# EAGLE schematic GSElogger (EAGLE 9.6.2)
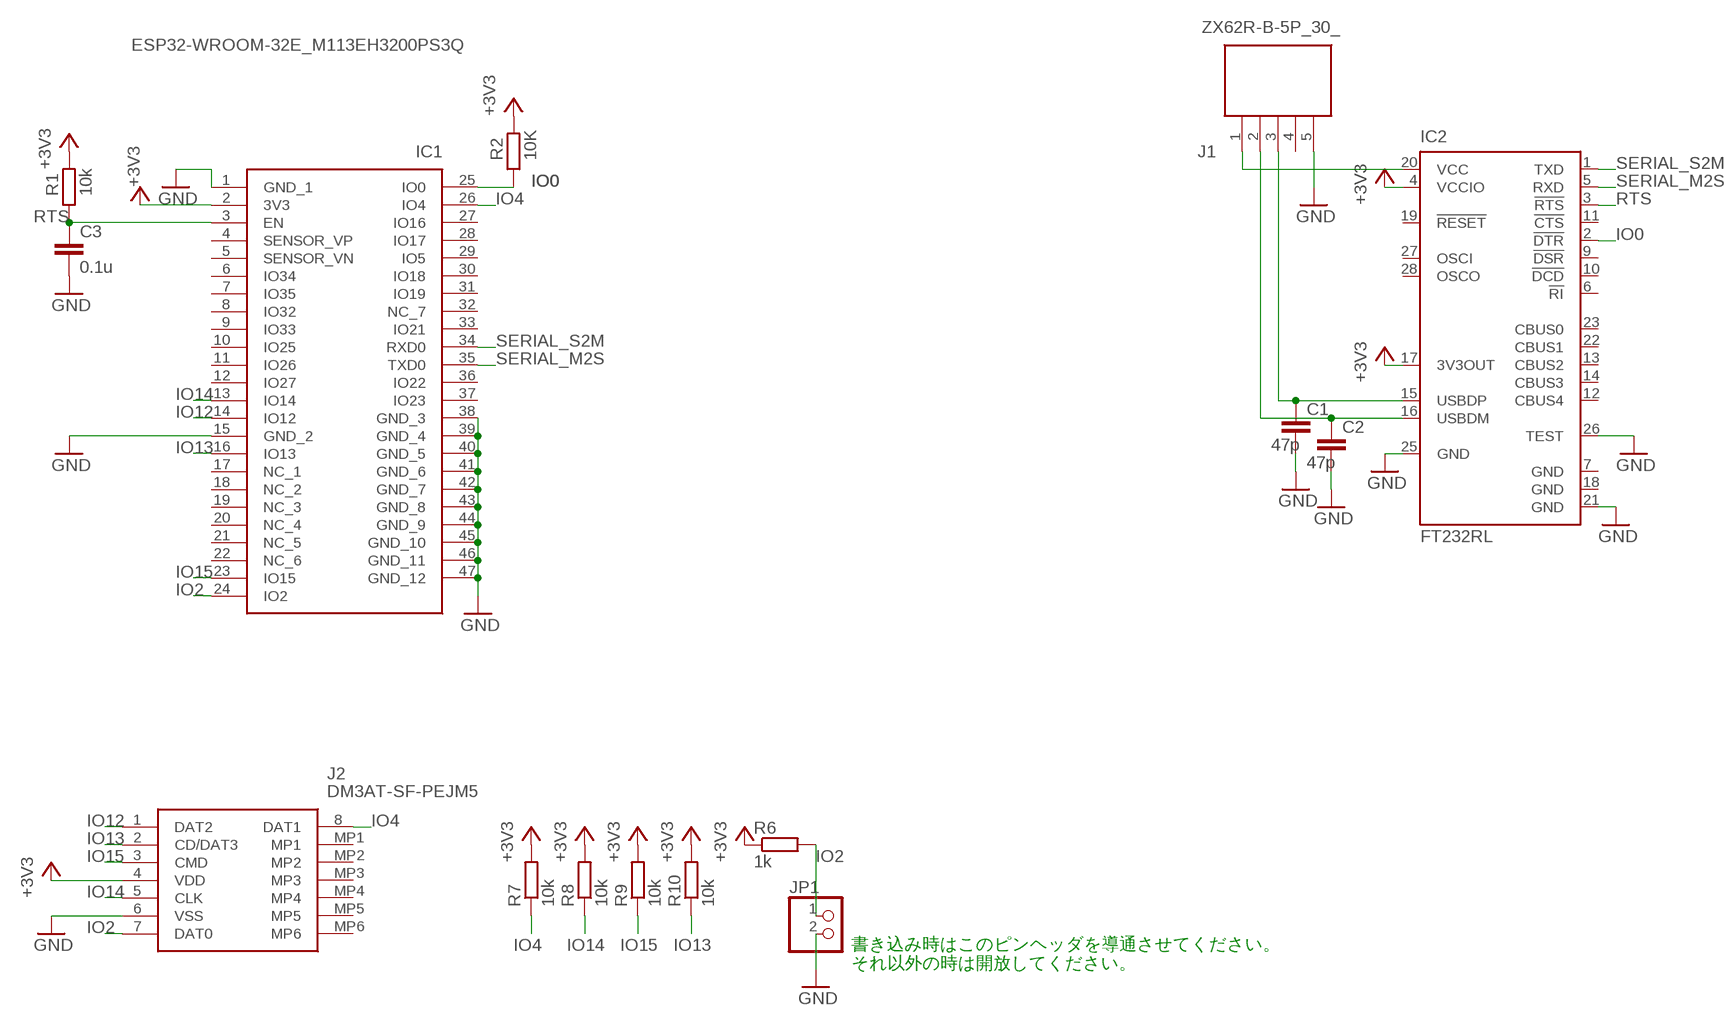
[diagram p0: schematic, sheet 1]

## Parts
C1  47p  C-EUC0603  [C0603]
C2  47p  C-EUC0603  [C0603]
C3  0.1u  C-EUC0603  [C0603]
IC1  ESP32-WROOM-32E_M113EH3200PS3Q  [ESP32WROOM32EM113EH3200PS3Q0]
IC2  FT232RL  [SSOP28]
J1  ZX62R-B-5P_30_  [ZX62R-B-5P(30)]
J2  DM3AT-SF-PEJM5  [DM3ATSFPEJM5]
JP1  PINHD-1X2  [1X02]
R1  10k  R-EU_R0603  [R0603]
R2  10K  R-EU_R0603  [R0603]
R6  1k  R-EU_R0603  [R0603]
R7  10k  R-EU_R0603  [R0603]
R8  10k  R-EU_R0603  [R0603]
R9  10k  R-EU_R0603  [R0603]
R10  10k  R-EU_R0603  [R0603]

## Nets
+3V3: IC1.2(3V3) IC2.4(VCCIO) IC2.17(3V3OUT) J2.4(VDD) R1.2 R2.2 R6.1 R7.2 R8.2 R9.2 R10.2
GND: C1.2 C2.2 C3.2 IC1.1(GND_1) IC1.15(GND_2) IC1.38(GND_3) IC1.39(GND_4) IC1.40(GND_5) IC1.41(GND_6) IC1.42(GND_7) IC1.43(GND_8) IC1.44(GND_9) IC1.45(GND_10) IC1.46(GND_11) IC1.47(GND_12) IC2.21(GND) IC2.25(GND) IC2.26(TEST) J1.5 J2.6(VSS) JP1.2
IO0: IC1.25(IO0) IC2.2(!DTR) R2.1
IO2: IC1.24(IO2) J2.7(DAT0) JP1.1 R6.2
IO4: IC1.26(IO4) J2.8(DAT1) R7.1
IO12: IC1.14(IO12) J2.1(DAT2)
IO13: IC1.16(IO13) J2.2(CD/DAT3) R10.1
IO14: IC1.13(IO14) J2.5(CLK) R8.1
IO15: IC1.23(IO15) J2.3(CMD) R9.1
N$2: IC2.20(VCC) J1.1
N$3: C2.1 IC2.16(USBDM) J1.2
N$4: C1.1 IC2.15(USBDP) J1.3
RTS: C3.1 IC1.3(EN) IC2.3(!RTS) R1.1
SERIAL_M2S: IC1.35(TXD0) IC2.5(RXD)
SERIAL_S2M: IC1.34(RXD0) IC2.1(TXD)
Unconnected: IC1.4(SENSOR_VP) IC1.5(SENSOR_VN) IC1.6(IO34) IC1.7(IO35) IC1.8(IO32) IC1.9(IO33) IC1.10(IO25) IC1.11(IO26) IC1.12(IO27) IC1.17(NC_1) IC1.18(NC_2) IC1.19(NC_3) IC1.20(NC_4) IC1.21(NC_5) IC1.22(NC_6) IC1.27(IO16) IC1.28(IO17) IC1.29(IO5) IC1.30(IO18) IC1.31(IO19) IC1.32(NC_7) IC1.33(IO21) IC1.36(IO22) IC1.37(IO23) IC2.6(!RI) IC2.9(!DSR) IC2.10(!DCD) IC2.11(!CTS) IC2.12(CBUS4) IC2.13(CBUS2) IC2.14(CBUS3) IC2.19(!RESET) IC2.22(CBUS1) IC2.23(CBUS0) IC2.27(OSCI) IC2.28(OSCO) J1.4 J2.MP1 J2.MP2 J2.MP3 J2.MP4 J2.MP5 J2.MP6

## Notes on the sheet
- 書き込み時はこのピンヘッダを導通させてください。
  それ以外の時は開放してください。

## Power pins joined to a net without a drawn wire
GND: IC2.7(GND) IC2.18(GND)

## Library data of the parts
C1-C3 = rcl:C-EU: CAPACITOR, European symbol; SPICEPREFIX: C
IC1 = SamacSys_Parts:ESP32-WROOM-32E_M113EH3200PS3Q: WiFi Modules (802.11) SMD module, ESP32-D0WD-V3, ESP32 ECO V3, 4 MB SPI flash, PCB antenna, -40 C ~ +105 C. Source: Datasheet <https://www.espressif.com/sites/default/files/documentation/esp32-wroom-32e_esp32-wroom-32ue_datasheet_en.pdf>; DESCRIPTION: WiFi Modules (802.11) SMD module, ESP32-D0WD-V3, ESP32 ECO V3, 4 MB SPI flash, PCB antenna, -40 C ~ +105 C.; HEIGHT: 3.25mm; MANUFACTURER_NAME: Espressif Systems; MANUFACTURER_PART_NUMBER: ESP32-WROOM-32E(M113EH3200PS3Q0); MOUSER_PART_NUMBER: 356-ESP32WRM320EH3PS; MOUSER_PRICE-STOCK: https://www.mouser.co.uk/ProductDetail/Espressif-Systems/ESP32-WROOM-32EM113EH3200PS3Q0?qs=sPbYRqrBIVkiZhzSFda8%2FA%3D%3D
IC2 = ftdichip:FT232R: Source: http://www.ftdichip.com/Documents/DataSheets/DS_FT232R_v104.pdf; MPN: FT232RL; OC_FARNELL: 1146032; OC_NEWARK: 91K9918
J1 = SamacSys_Parts:ZX62R-B-5P_30_: Hirose ZX, Straight SMT, Type B Version 2.0 Micro USB Connector Receptacle Source: Datasheet <http://www.farnell.com/datasheets/2360818.pdf>; ARROW_PART_NUMBER: ZX62R-B-5P(30); ARROW_PRICE-STOCK: https://www.arrow.com/en/products/zx62r-b-5p-30/hirose-electric; DESCRIPTION: Hirose ZX, Straight SMT, Type B Version 2.0 Micro USB Connector Receptacle; HEIGHT: mm; MANUFACTURER_NAME: Hirose; MANUFACTURER_PART_NUMBER: ZX62R-B-5P(30); MOUSER_PART_NUMBER: 798-ZX62R-B-5P30; MOUSER_PRICE-STOCK: https://www.mouser.co.uk/ProductDetail/Hirose-Connector/ZX62R-B-5P30?qs=4J5DPWWS9EAThzyZtJ4A7A%3D%3D
J2 = SamacSys_Parts:DM3AT-SF-PEJM5: Memory Card Connectors R/A SMT MICROSD CON PUSH-PUSH TOP BRDMNT Source: Datasheet <https://datasheet.lcsc.com/szlcsc/Hirose-HRS-DM3AT-SF-PEJM5_C114218.pdf>; DESCRIPTION: Memory Card Connectors R/A SMT MICROSD CON PUSH-PUSH TOP BRDMNT; HEIGHT: 1.83mm; MANUFACTURER_NAME: Hirose; MANUFACTURER_PART_NUMBER: DM3AT-SF-PEJM5; MOUSER_PART_NUMBER: 798-DM3AT-SF-PEJM5; MOUSER_PRICE-STOCK: https://www.mouser.co.uk/ProductDetail/Hirose-Connector/DM3AT-SF-PEJM5?qs=LZSZKJVF%252B2WTDKp%252BR7IYAQ%3D%3D
JP1 = pinhead:PINHD-1X2: PIN HEADER
R1 R2 R6-R10 = rcl:R-EU_: RESISTOR, European symbol; SPICEPREFIX: R